# EAGLE schematic Schematic_DACPCM1780LP-filter_2 (EAGLE 9.6.0)
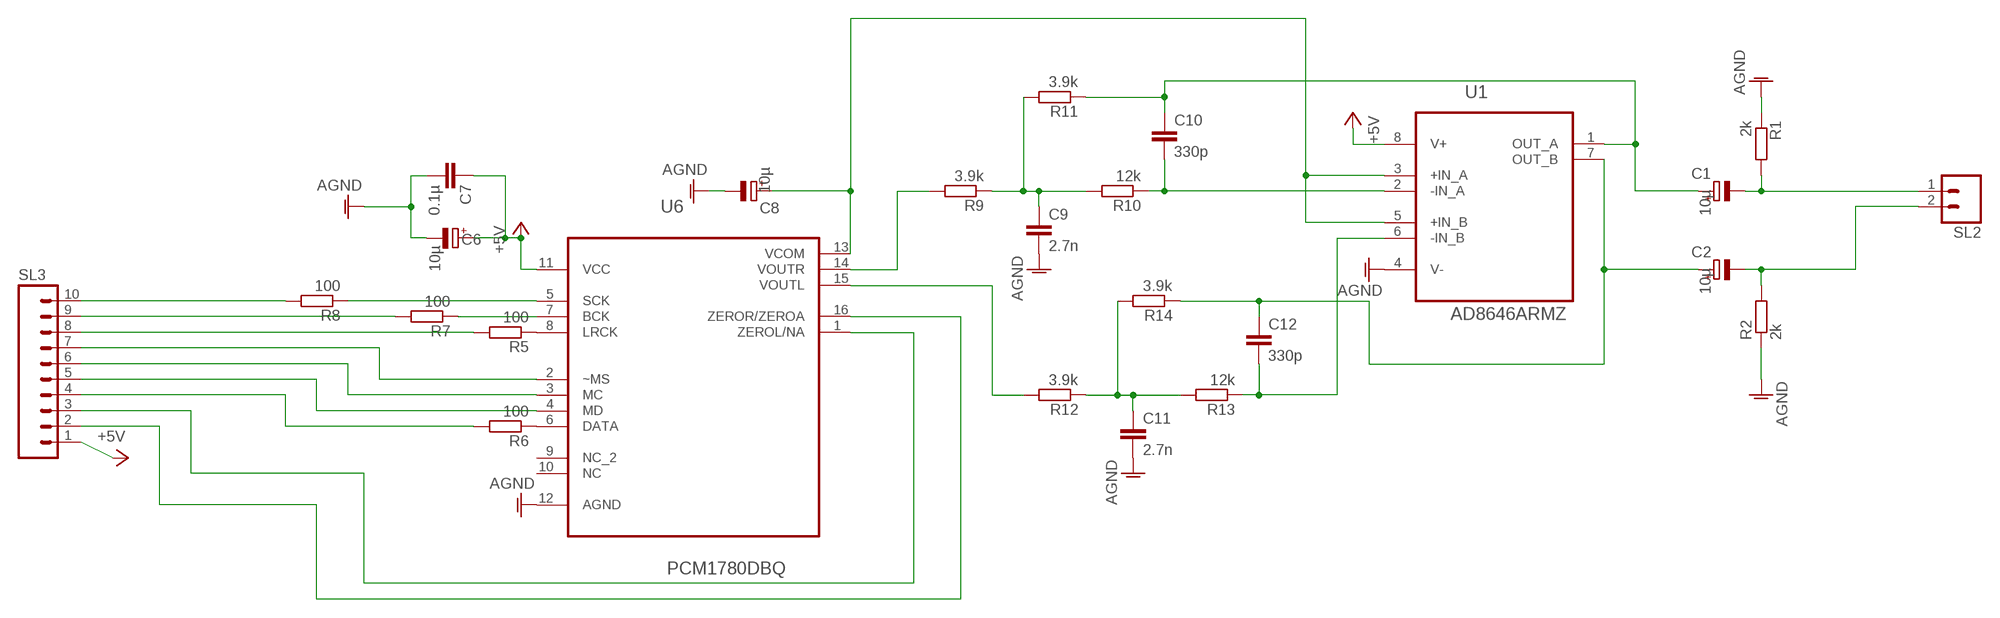
[diagram p0: schematic, sheet 1]

## Parts
C1  10µ  CPOL-EU085CS-1AR  [085CS_1AR]
C2  10µ  CPOL-EU085CS-1AR  [085CS_1AR]
C6  10µ  CPOL-EU085CS-1AR  [085CS_1AR]
C7  0.1µ  C-EUC0805K  [C0805K]
C8  10µ  CPOL-EU085CS-1AR  [085CS_1AR]
C9  2.7n  C-EUC0805K  [C0805K]
C10  330p  C-EUC0805K  [C0805K]
C11  2.7n  C-EUC0805K  [C0805K]
C12  330p  C-EUC0805K  [C0805K]
R1  2k  R-EU_M0805  [M0805]
R2  2k  R-EU_M0805  [M0805]
R5  100  R-EU_M0805  [M0805]
R6  100  R-EU_M0805  [M0805]
R7  100  R-EU_M0805  [M0805]
R8  100  R-EU_M0805  [M0805]
R9  3.9k  R-EU_M0805  [M0805]
R10  12k  R-EU_M0805  [M0805]
R11  3.9k  R-EU_M0805  [M0805]
R12  3.9k  R-EU_M0805  [M0805]
R13  12k  R-EU_M0805  [M0805]
R14  3.9k  R-EU_M0805  [M0805]
SL2  M02  [02P]
SL3  M10  [10P]
U1  AD8646ARMZ  [SOP65P490X110-8N]
U6  PCM1780DBQ  [SOP63P600X175-16N]

## Nets
+5V: C6.+ C7.1 SL3.1 U1.8(V+) U6.11(VCC)
AGND: C6.- C7.2 C8.- C9.2 C11.2 R1.1 R2.1 U1.4(V-) U6.12(AGND)
N$1: C1.- R1.2 SL2.1
N$2: C2.+ C12.1 R14.1 U1.7(OUT_B)
N$3: C2.- R2.2 SL2.2
N$20: R5.1 U6.8(LRCK)
N$21: R6.1 U6.6(DATA)
N$22: R8.2 SL3.10
N$23: R7.1 U6.7(BCK)
N$24: R8.1 U6.5(SCK)
N$25: C8.+ U1.3(+IN_A) U1.5(+IN_B) U6.13(VCOM)
N$26: R9.2 U6.14(VOUTR)
N$27: C9.1 R9.1 R10.2 R11.2
N$28: C1.+ C10.1 R11.1 U1.1(OUT_A)
N$29: C10.2 R10.1 U1.2(-IN_A)
N$30: R12.2 U6.15(VOUTL)
N$31: C11.1 R12.1 R13.2 R14.2
N$33: C12.2 R13.1 U1.6(-IN_B)
N$34: R7.2 SL3.9
N$35: R5.2 SL3.8
N$36: SL3.7 U6.2(~MS)
N$37: SL3.6 U6.3(MC)
N$38: SL3.5 U6.4(MD)
N$39: R6.2 SL3.4
N$40: SL3.2 U6.16(ZEROR/ZEROA)
N$41: SL3.3 U6.1(ZEROL/NA)
Unconnected: U6.9(NC_2) U6.10(NC)

## Library data of the parts
C1 C2 C6 C8 = rcl:CPOL-EU: POLARIZED CAPACITOR, European symbol; SPICEPREFIX: C
C7 C9-C12 = rcl:C-EU: CAPACITOR, European symbol; SPICEPREFIX: C
R1 R2 R5-R14 = rcl:R-EU_: RESISTOR, European symbol; SPICEPREFIX: R
SL2 = con-amp-quick:M02: AMP QUICK CONNECTOR; OC_FARNELL: unknown; OC_NEWARK: unknown
SL3 = con-amp-quick:M10: AMP QUICK CONNECTOR; OC_FARNELL: unknown; OC_NEWARK: unknown
U1 = AD8646ARMZ:AD8646ARMZ: Rail-to-Rail Amplifiers Check prices <https://pricing.snapeda.com/parts/AD8646ARMZ/Analog%20Devices/view-part?ref=eda>; AVAILABILITY: Good; DESCRIPTION: General Purpose Amplifier 2 Circuit Rail-to-Rail 8-MSOP; MF: Analog Devices; MP: AD8646ARMZ; PACKAGE: MSOP-8 Analog Devices; PRICE: None; PURCHASE-URL: https://pricing.snapeda.com/search/part/AD8646ARMZ/?ref=eda
U6 = PCM1780DBQ:PCM1780DBQ: Digital-to-Analog Converter; AVAILABILITY: Unavailable; DESCRIPTION: 106dB SNR Stereo DAC (S/W Control) 16-SSOP -20 to 85; MF: Texas Instruments; MP: PCM1780DBQ; PACKAGE: SSOP-16 Texas Instruments; PRICE: None; PURCHASE-URL: https://pricing.snapeda.com/search/part/PCM1780DBQ/?ref=eda